# EAGLE schematic PSU+GainStage (EAGLE 7.6.0)
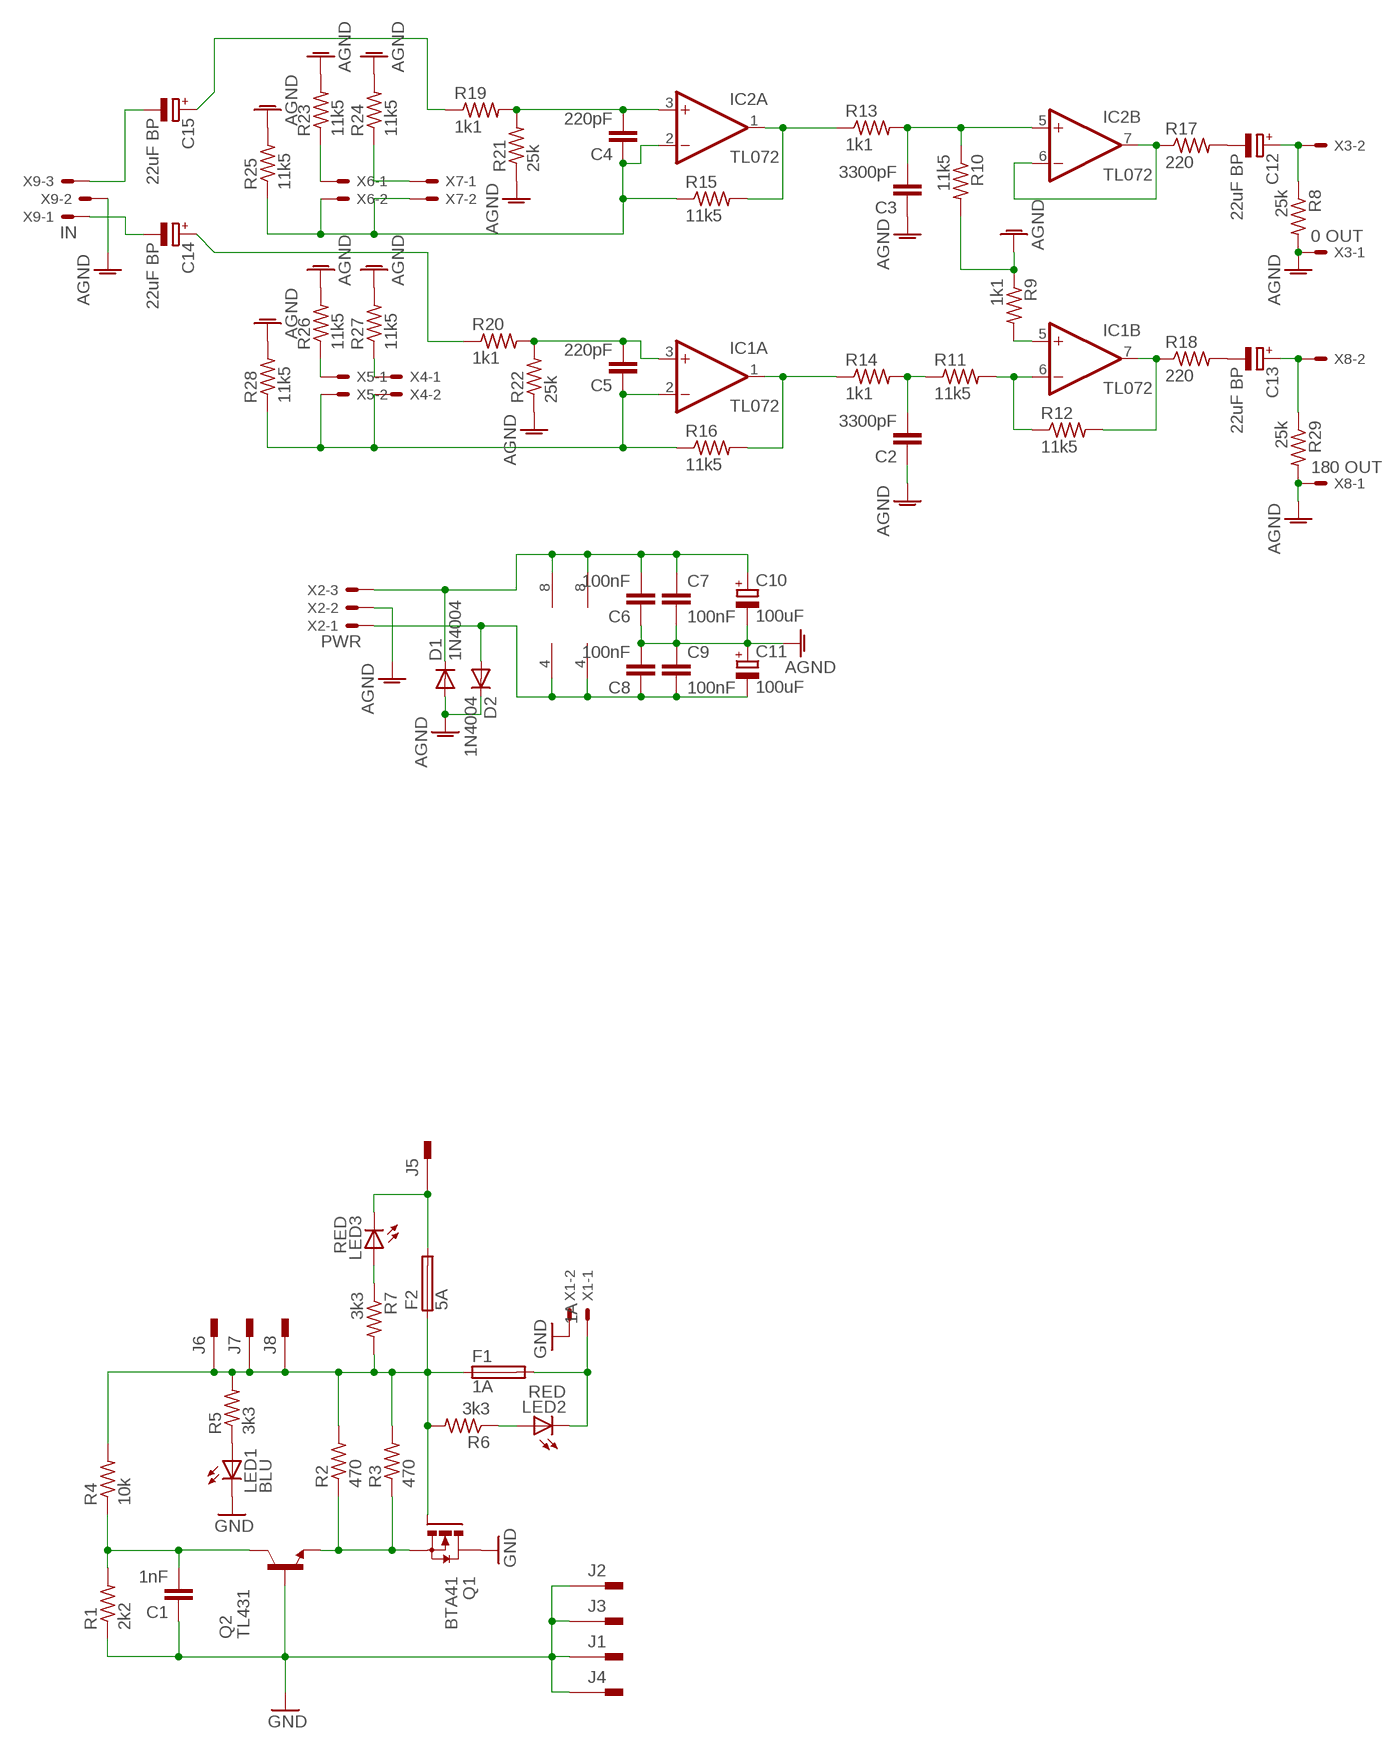
[diagram p0: schematic, sheet 1]

## Parts
C1  1nF  C-EU050-035X075  [C050-035X075]
C2  3300pF  C-EU050-035X075  [C050-035X075]
C3  3300pF  C-EU050-035X075  [C050-035X075]
C4  220pF  C-EU050-035X075  [C050-035X075]
C5  220pF  C-EU050-035X075  [C050-035X075]
C6  100nF  C-EUC1210  [C1210]
C7  100nF  C-EUC1210  [C1210]
C8  100nF  C-EUC1210  [C1210]
C9  100nF  C-EUC1210  [C1210]
C10  100uF  CPOL-EUE5-8.5  [E5-8,5]
C11  100uF  CPOL-EUE5-8.5  [E5-8,5]
C12  22uF BP  CPOL-EUE3.5-10  [E3,5-10]
C13  22uF BP  CPOL-EUE3.5-10  [E3,5-10]
C14  22uF BP  CPOL-EUE3.5-10  [E3,5-10]
C15  22uF BP  CPOL-EUE3.5-10  [E3,5-10]
D1  1N4004  [DO41-10]
D2  1N4004  [DO41-10]
F1  1A  TR5  [TR5]
F2  5A  TR5  [TR5]
IC1  TL072  LM1458N  [DIL08]
IC2  TL072  LM1458N  [DIL08]
J1  PIN2F061.040  [F061.040]
J2  PIN2F061.040  [F061.040]
J3  PIN2F061.040  [F061.040]
J4  PIN2F061.040  [F061.040]
J5  PIN2F061.040  [F061.040]
J6  PIN2F061.040  [F061.040]
J7  PIN2F061.040  [F061.040]
J8  PIN2F061.040  [F061.040]
LED1  BLU  LED5MM  [LED5MM]
LED2  RED  LED5MM  [LED5MM]
LED3  RED  LED5MM  [LED5MM]
Q1  BTA41  IRFP240  [TO247BV]
Q2  TL431  BC449  [TO92-EBC]
R1  2k2  R-US_0309/12  [0309/12]
R2  470  R-US_0411/15  [0411/15]
R3  470  R-US_0411/15  [0411/15]
R4  10k  R-US_0309/12  [0309/12]
R5  3k3  R-US_0309/12  [0309/12]
R6  3k3  R-US_0309/12  [0309/12]
R7  3k3  R-US_0309/12  [0309/12]
R8  25k  R-US_0309/12  [0309/12]
R9  1k1  R-US_0309/12  [0309/12]
R10  11k5  R-US_0309/12  [0309/12]
R11  11k5  R-US_0309/10  [0309/10]
R12  11k5  R-US_0309/10  [0309/10]
R13  1k1  R-US_0309/12  [0309/12]
R14  1k1  R-US_0309/12  [0309/12]
R15  11k5  R-US_0309/10  [0309/10]
R16  11k5  R-US_0309/10  [0309/10]
R17  220  R-US_0309/12  [0309/12]
R18  220  R-US_0309/10  [0309/10]
R19  1k1  R-US_0309/12  [0309/12]
R20  1k1  R-US_0309/10  [0309/10]
R21  25k  R-US_0309/10  [0309/10]
R22  25k  R-US_0309/10  [0309/10]
R23  11k5  R-US_0309/10  [0309/10]
R24  11k5  R-US_0309/10  [0309/10]
R25  11k5  R-US_0309/10  [0309/10]
R26  11k5  R-US_0309/10  [0309/10]
R27  11k5  R-US_0309/10  [0309/10]
R28  11k5  R-US_0309/10  [0309/10]
R29  25k  R-US_0309/12  [0309/12]
X1  1A  22-23-2021  [22-23-2021]
X2  PWR  22-23-2031  [22-23-2031]
X3  0 OUT  22-23-2021  [22-23-2021]
X4  22-23-2021  [22-23-2021]
X5  22-23-2021  [22-23-2021]
X6  22-23-2021  [22-23-2021]
X7  22-23-2021  [22-23-2021]
X8  180 OUT  22-23-2021  [22-23-2021]
X9  IN  22-23-2031  [22-23-2031]

## Nets
AGND: C2.1 C3.1 C6.1 C7.2 C8.2 C9.1 C10.- C11.+ D1.A D2.C R8.2 R9.1 R10.2 R21.1 R22.1 R23.2 R24.2 R25.2 R26.2 R27.2 R28.2 R29.2 X2.2 X3.1 X8.1 X9.2
GND: C1.1 J1.A1 J1.A2 J2.A1 J2.A2 J3.A1 J3.A2 J4.A1 J4.A2 LED1.K(C) Q1.D Q2.B R1.1 X1.2
N$1: Q1.S Q2.E R2.1 R3.1
N$2: F1.1 F2.1 J6.A1 J6.A2 J7.A1 J7.A2 J8.A1 J8.A2 Q1.G R2.2 R3.2 R4.2 R5.2 R6.2 R7.2
N$3: C1.2 Q2.C R1.2 R4.1
N$4: LED3.A R7.1
N$5: F2.2 J5.A1 J5.A2 LED3.K(C)
N$6: LED1.A R5.1
N$7: F1.2 LED2.K(C) X1.1
N$8: LED2.A R6.1
N$9: C12.- R17.2
N$10: C6.2 C7.1 C10.+ D1.C IC1.8(P:V+) IC2.8(P:V+) X2.3
N$11: C8.1 C9.2 C11.- D2.A IC1.4(P:V-) IC2.4(P:V-) X2.1
N$12: IC2.6(B:-IN) IC2.7(B:OUT) R17.1
N$13: IC1.5(B:+IN) R9.2
N$14: C3.2 IC2.5(B:+IN) R10.1 R13.2
N$15: IC1.6(B:-IN) R11.2 R12.1
N$16: IC1.7(B:OUT) R12.2 R18.1
N$17: C2.2 R11.1 R14.2
N$18: IC2.1(A:OUT) R13.1 R15.2
N$19: IC1.1(A:OUT) R14.1 R16.2
N$20: C4.2 IC2.3(A:+IN) R19.2 R21.2
N$21: C4.1 IC2.2(A:-IN) R15.1 R25.1 X6.2 X7.2
N$22: C5.1 IC1.2(A:-IN) R16.1 R28.1 X4.2 X5.2
N$23: C5.2 IC1.3(A:+IN) R20.2 R22.2
N$24: R26.1 X5.1
N$25: R27.1 X4.1
N$26: R24.1 X7.1
N$27: R23.1 X6.1
N$28: C13.- R18.2
N$29: C12.+ R8.1 X3.2
N$30: C13.+ R29.1 X8.2
N$31: C15.+ R19.1
N$32: C14.+ R20.1
N$33: C14.- X9.1
N$34: C15.- X9.3

## Library data of the parts
C1-C9 = resistor:C-EU: CAPACITOR, European symbol
C10-C15 = resistor:CPOL-EU: POLARIZED CAPACITOR, European symbol
D1 D2 = diode:1N4004: DIODE general purpose rectifier, 1 A
F1 F2 = fuse:TR5: FUSE Wickmann; OC_FARNELL: unknown; OC_NEWARK: unknown
IC1 IC2 = linear:*1458: OP AMP
J1-J8 = con-faston:PIN2: Flachstecker Typ Tyco/Electronics/AMP TAB, FASTON Printed Circuit Board Tabs Source: http://www.buerklin.com, http://catalog.tycoelectronics.com; OC_FARNELL: unknown; OC_NEWARK: unknown
LED1-LED3 = led:LED: LED OSRAM: - CHIPLED LG R971, LG N971, LY N971, LG Q971, LY Q971, LO R971, LY R971 LH N974, LH R974 LS Q976, LO Q976, LY Q976 LO Q996 - Hyper CHIPLED LW Q18S LB Q993, LB Q99A, LB R99A - SideLED LS A670, LO A670, LY A670, LG A670, LP A670 LB A673, LV A673, LT A673, LW A673 LH A674 LY A675 LS A676, LA A676, LO A676, LY A676, LW A676 LS A679, LY A679, LG A679 - Hyper Micro SIDELED® LS Y876, LA Y876, LO Y876, LY Y876 LT Y87S - SmartLED LW L88C, LW L88S LB L89C, LB L89S, LG L890 LS L89K, LO L89K, LY L89K LS L896, LA L896, LO L896, LY L896 - TOPLED LS T670, LO T670, LY T670, LG T670, LP T670 LSG T670, LSP T670, LSY T670, LOP T670, LYG T670 LG T671, LOG T671, LSG T671 LB T673, LV T673, LT T673, LW T673 LH T674 LS T676, LA T676, LO T676, LY T676, LB T676, LH T676, LSB T676, LW T676 LB T67C, LV T67C, LT T67C, LS T67K, LO T67K, LY T67K, LW E67C LS E67B, LA E67B, LO E67B, LY E67B, LB E67C, LV E67C, LT E67C LW T67C LS T679, LY T679, LG T679 LS T770, LO T770, LY T770, LG T770, LP T770 LB T773, LV T773, LT T773, LW T773 LH T774 LS E675, LA E675, LY E675, LS T675 LS T776, LA T776, LO T776, LY T776, LB T776 LHGB T686 LT T68C, LB T68C - Hyper Mini TOPLED® LB M676 - Mini TOPLED Santana® LG M470 LS M47K, LO M47K, LY M47K Source: http://www.osram.convergy.de LUXEON: - LUMILED® LXK2-PW12-R00, LXK2-PW12-S00, LXK2-PW14-U00, LXK2-PW14-V00 LXK2-PM12-R00, LXK2-PM12-S00, LXK2-PM14-U00 LXK2-PE12-Q00, LXK2-PE12-R00, LXK2-PE12-S00, LXK2-PE14-T00, LXK2-PE14-U00 LXK2-PB12-K00, LXK2-PB12-L00, LXK2-PB12-M00, LXK2-PB14-N00, LXK2-PB14-P00, LXK2-PB14-Q00 LXK2-PR12-L00, LXK2-PR12-M00, LXK2-PR14-Q00, LXK2-PR14-R00 LXK2-PD12-Q00, LXK2-PD12-R00, LXK2-PD12-S00 LXK2-PH12-R00, LXK2-PH12-S00 LXK2-PL12-P00, LXK2-PL12-Q00, LXK2-PL12-R00 Source: www.luxeon.com KINGBRIGHT: KA-3528ASYC Source: www.kingbright.com
Q1 = transistor-power:IRFP240: HEXFET Power MosFet Source: http://www.irf.com/
Q2 = transistor-npn:BC449*: NPN Transistor
R1-R29 = resistor:R-US_: RESISTOR, American symbol
X1 X3-X8 = con-molex:22-23-2021: .100" (2.54mm) Center Header - 2 Pin; MF: MOLEX; MPN: 22-23-2021; OC_FARNELL: 1462926; OC_NEWARK: 25C3832
X2 X9 = con-molex:22-23-2031: .100" (2.54mm) Center Header - 3 Pin; MF: MOLEX; MPN: 22-23-2031; OC_FARNELL: 1462950; OC_NEWARK: 30C0862